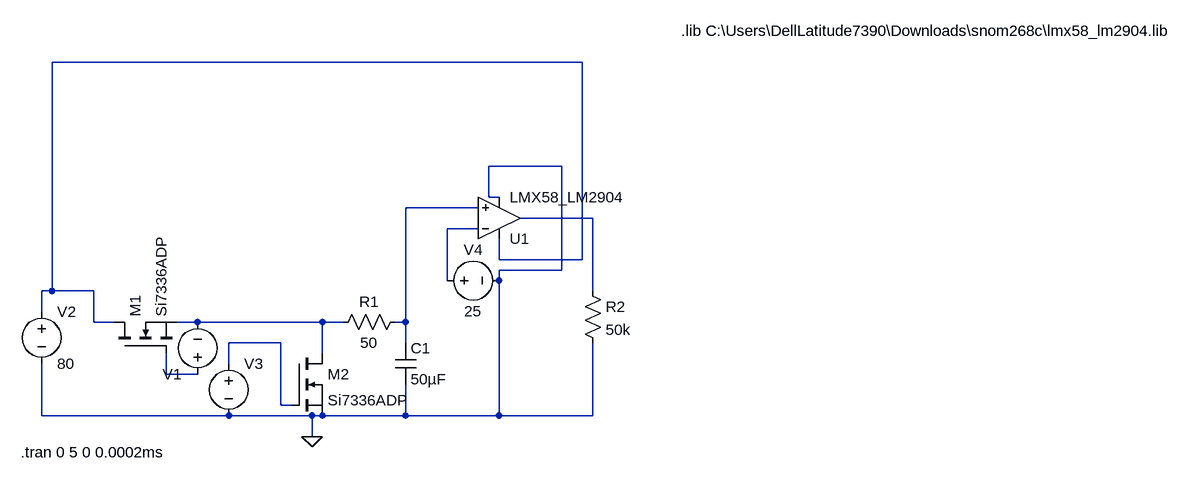
[diagram p0: schematic ADC.asc]
ADC.asc, the LTspice schematic file:
Version 4
SHEET 1 1520 680
WIRE 512 -336 -304 -336
WIRE 480 -176 368 -176
WIRE 368 -128 368 -176
WIRE 384 -128 368 -128
WIRE 352 -112 240 -112
WIRE 528 -96 416 -96
WIRE 352 -80 304 -80
WIRE 384 -32 384 -64
WIRE 512 -32 512 -336
WIRE 512 -32 384 -32
WIRE 480 -16 480 -176
WIRE 480 -16 384 -16
WIRE 304 0 304 -80
WIRE 384 0 384 -16
WIRE -304 16 -304 -336
WIRE -304 16 -320 16
WIRE -240 16 -304 16
WIRE 528 16 528 -96
WIRE -320 48 -320 16
WIRE -240 64 -240 16
WIRE -208 64 -240 64
WIRE -80 64 -112 64
WIRE 112 64 -80 64
WIRE 144 64 112 64
WIRE 240 64 240 -112
WIRE 240 64 224 64
WIRE 48 96 -32 96
WIRE 240 96 240 64
WIRE 112 112 112 64
WIRE -32 128 -32 96
WIRE -128 144 -128 112
WIRE -80 144 -128 144
WIRE 48 192 48 96
WIRE 64 192 48 192
WIRE -320 208 -320 128
WIRE -32 208 -320 208
WIRE 96 208 -32 208
WIRE 112 208 96 208
WIRE 240 208 240 160
WIRE 240 208 112 208
WIRE 384 208 384 0
WIRE 384 208 240 208
WIRE 528 208 528 96
WIRE 528 208 384 208
WIRE 96 240 96 208
FLAG 96 240 0
SYMBOL voltage -80 160 R180
WINDOW 3 24 96 Invisible 2
WINDOW 123 0 0 Left 0
WINDOW 39 0 0 Left 0
SYMATTR Value PULSE(0 25 0 0 0 0.0625ms 0.125ms 1000000)
SYMATTR InstName V1
SYMBOL cap 224 96 R0
SYMATTR InstName C1
SYMATTR Value 50µF
SYMBOL res 128 80 R270
WINDOW 0 32 56 VTop 2
WINDOW 3 0 56 VBottom 2
SYMATTR InstName R1
SYMATTR Value 50
SYMBOL voltage -320 32 R0
WINDOW 123 0 0 Left 0
WINDOW 39 0 0 Left 0
SYMATTR InstName V2
SYMATTR Value 80
SYMBOL nmos -208 112 R270
SYMATTR InstName M1
SYMATTR Value Si7336ADP
SYMBOL nmos 64 112 R0
SYMATTR InstName M2
SYMATTR Value Si7336ADP
SYMBOL voltage -32 112 R0
WINDOW 3 24 96 Invisible 2
WINDOW 123 0 0 Left 0
WINDOW 39 0 0 Left 0
SYMATTR Value PULSE(0 25 0.0625ms 0 0 0.0625ms 0.125ms 1000000)
SYMATTR InstName V3
SYMBOL OpAmps\\opamp2 384 -32 M180
SYMATTR InstName U1
SYMATTR Value LMX58_LM2904
SYMBOL res 512 0 R0
SYMATTR InstName R2
SYMATTR Value 50k
SYMBOL voltage 288 0 R270
WINDOW 0 32 56 VTop 2
WINDOW 3 -32 56 VBottom 2
WINDOW 123 0 0 Left 0
WINDOW 39 0 0 Left 0
SYMATTR InstName V4
SYMATTR Value 25
TEXT -352 264 Left 2 !.tran 0 5 0 0.0002ms
TEXT 664 -384 Left 2 !.lib C:\\Users\\DellLatitude7390\\Downloads\\snom268c\\lmx58_lm2904.lib

The netlist it stands for:
* ADC.asc
V1 N007 N005 PULSE(0 25 0 0 0 0.0625ms 0.125ms 1000000)
C1 N002 0 50µF
R1 N005 N002 50
V2 N001 0 80
M1 N001 N007 N005 N005 Si7336ADP
M2 N005 N006 0 0 Si7336ADP
V3 N006 0 PULSE(0 25 0.0625ms 0 0 0.0625ms 0.125ms 1000000)
XU1 N002 N004 N001 0 N003 LMX58_LM2904  ; pins In+ In- V+ V- OUT
R2 N003 0 50k
V4 N004 0 25
.model NMOS NMOS
.model PMOS PMOS
.lib standard.mos
.tran 0 5 0 0.0002ms
.lib C:\Users\DellLatitude7390\Downloads\snom268c\lmx58_lm2904.lib
.backanno
.end